# EAGLE schematic LED-Matrix_v2 (EAGLE 9.7.0)
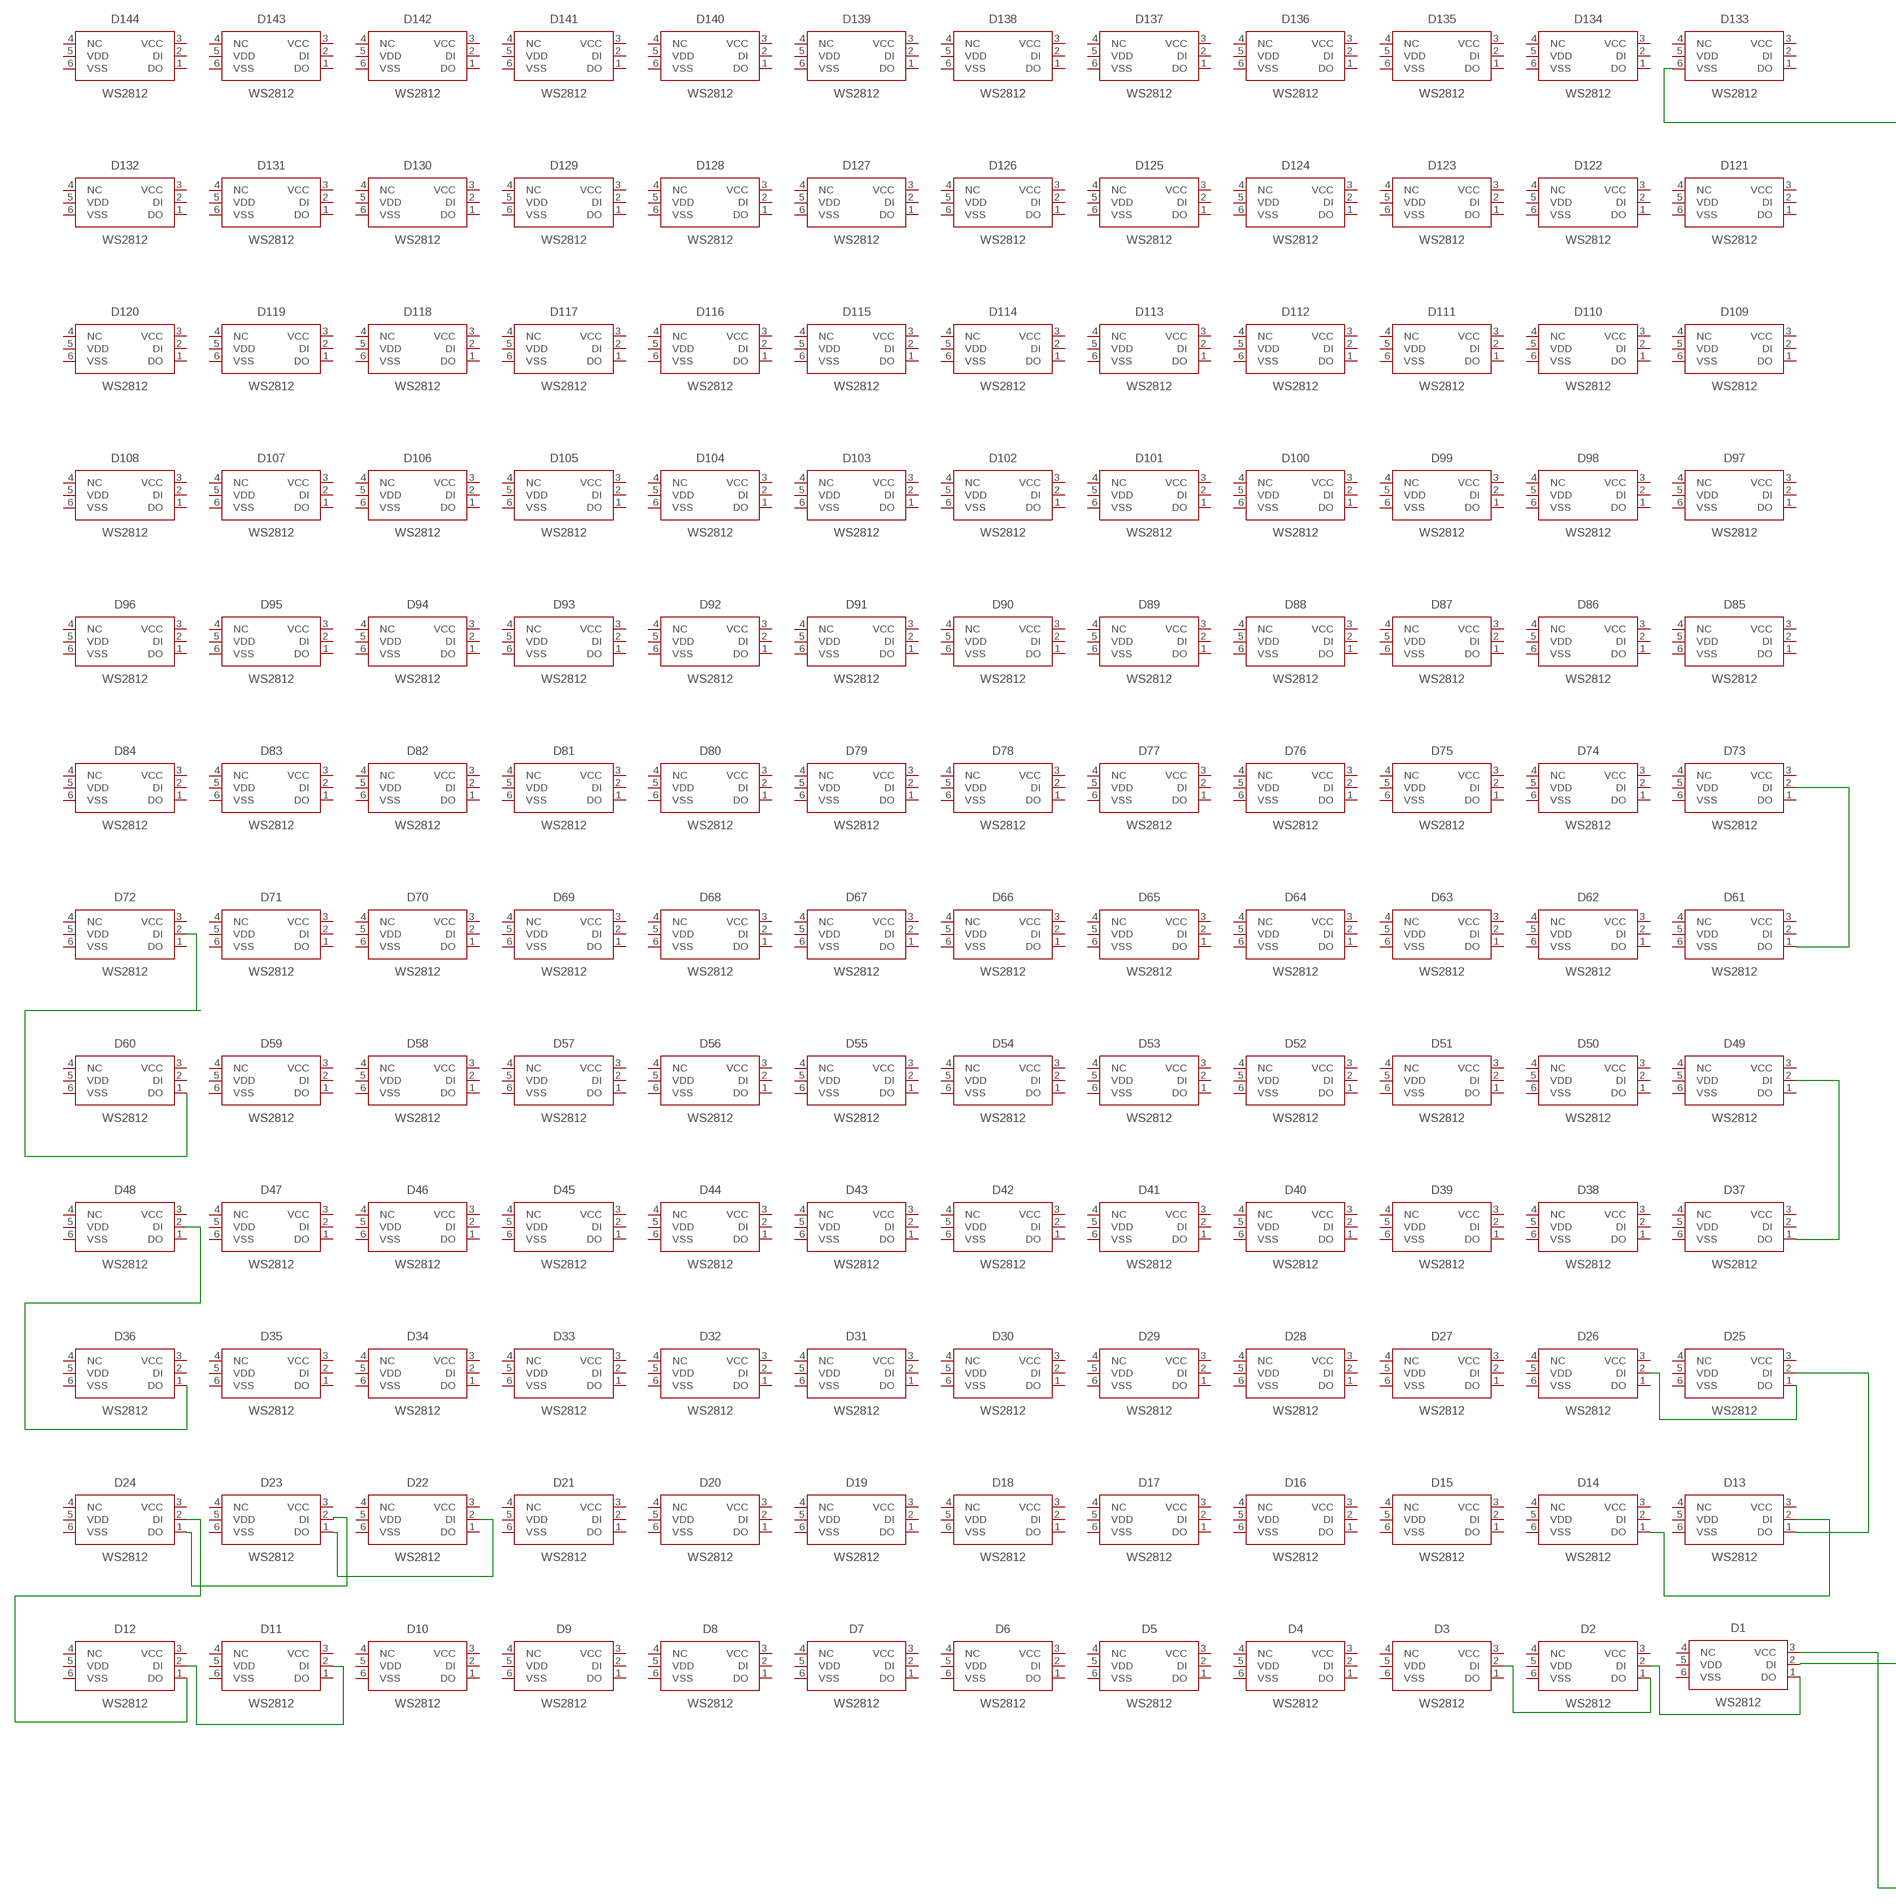
[diagram p0: schematic, sheet 1, part 1 of 2]
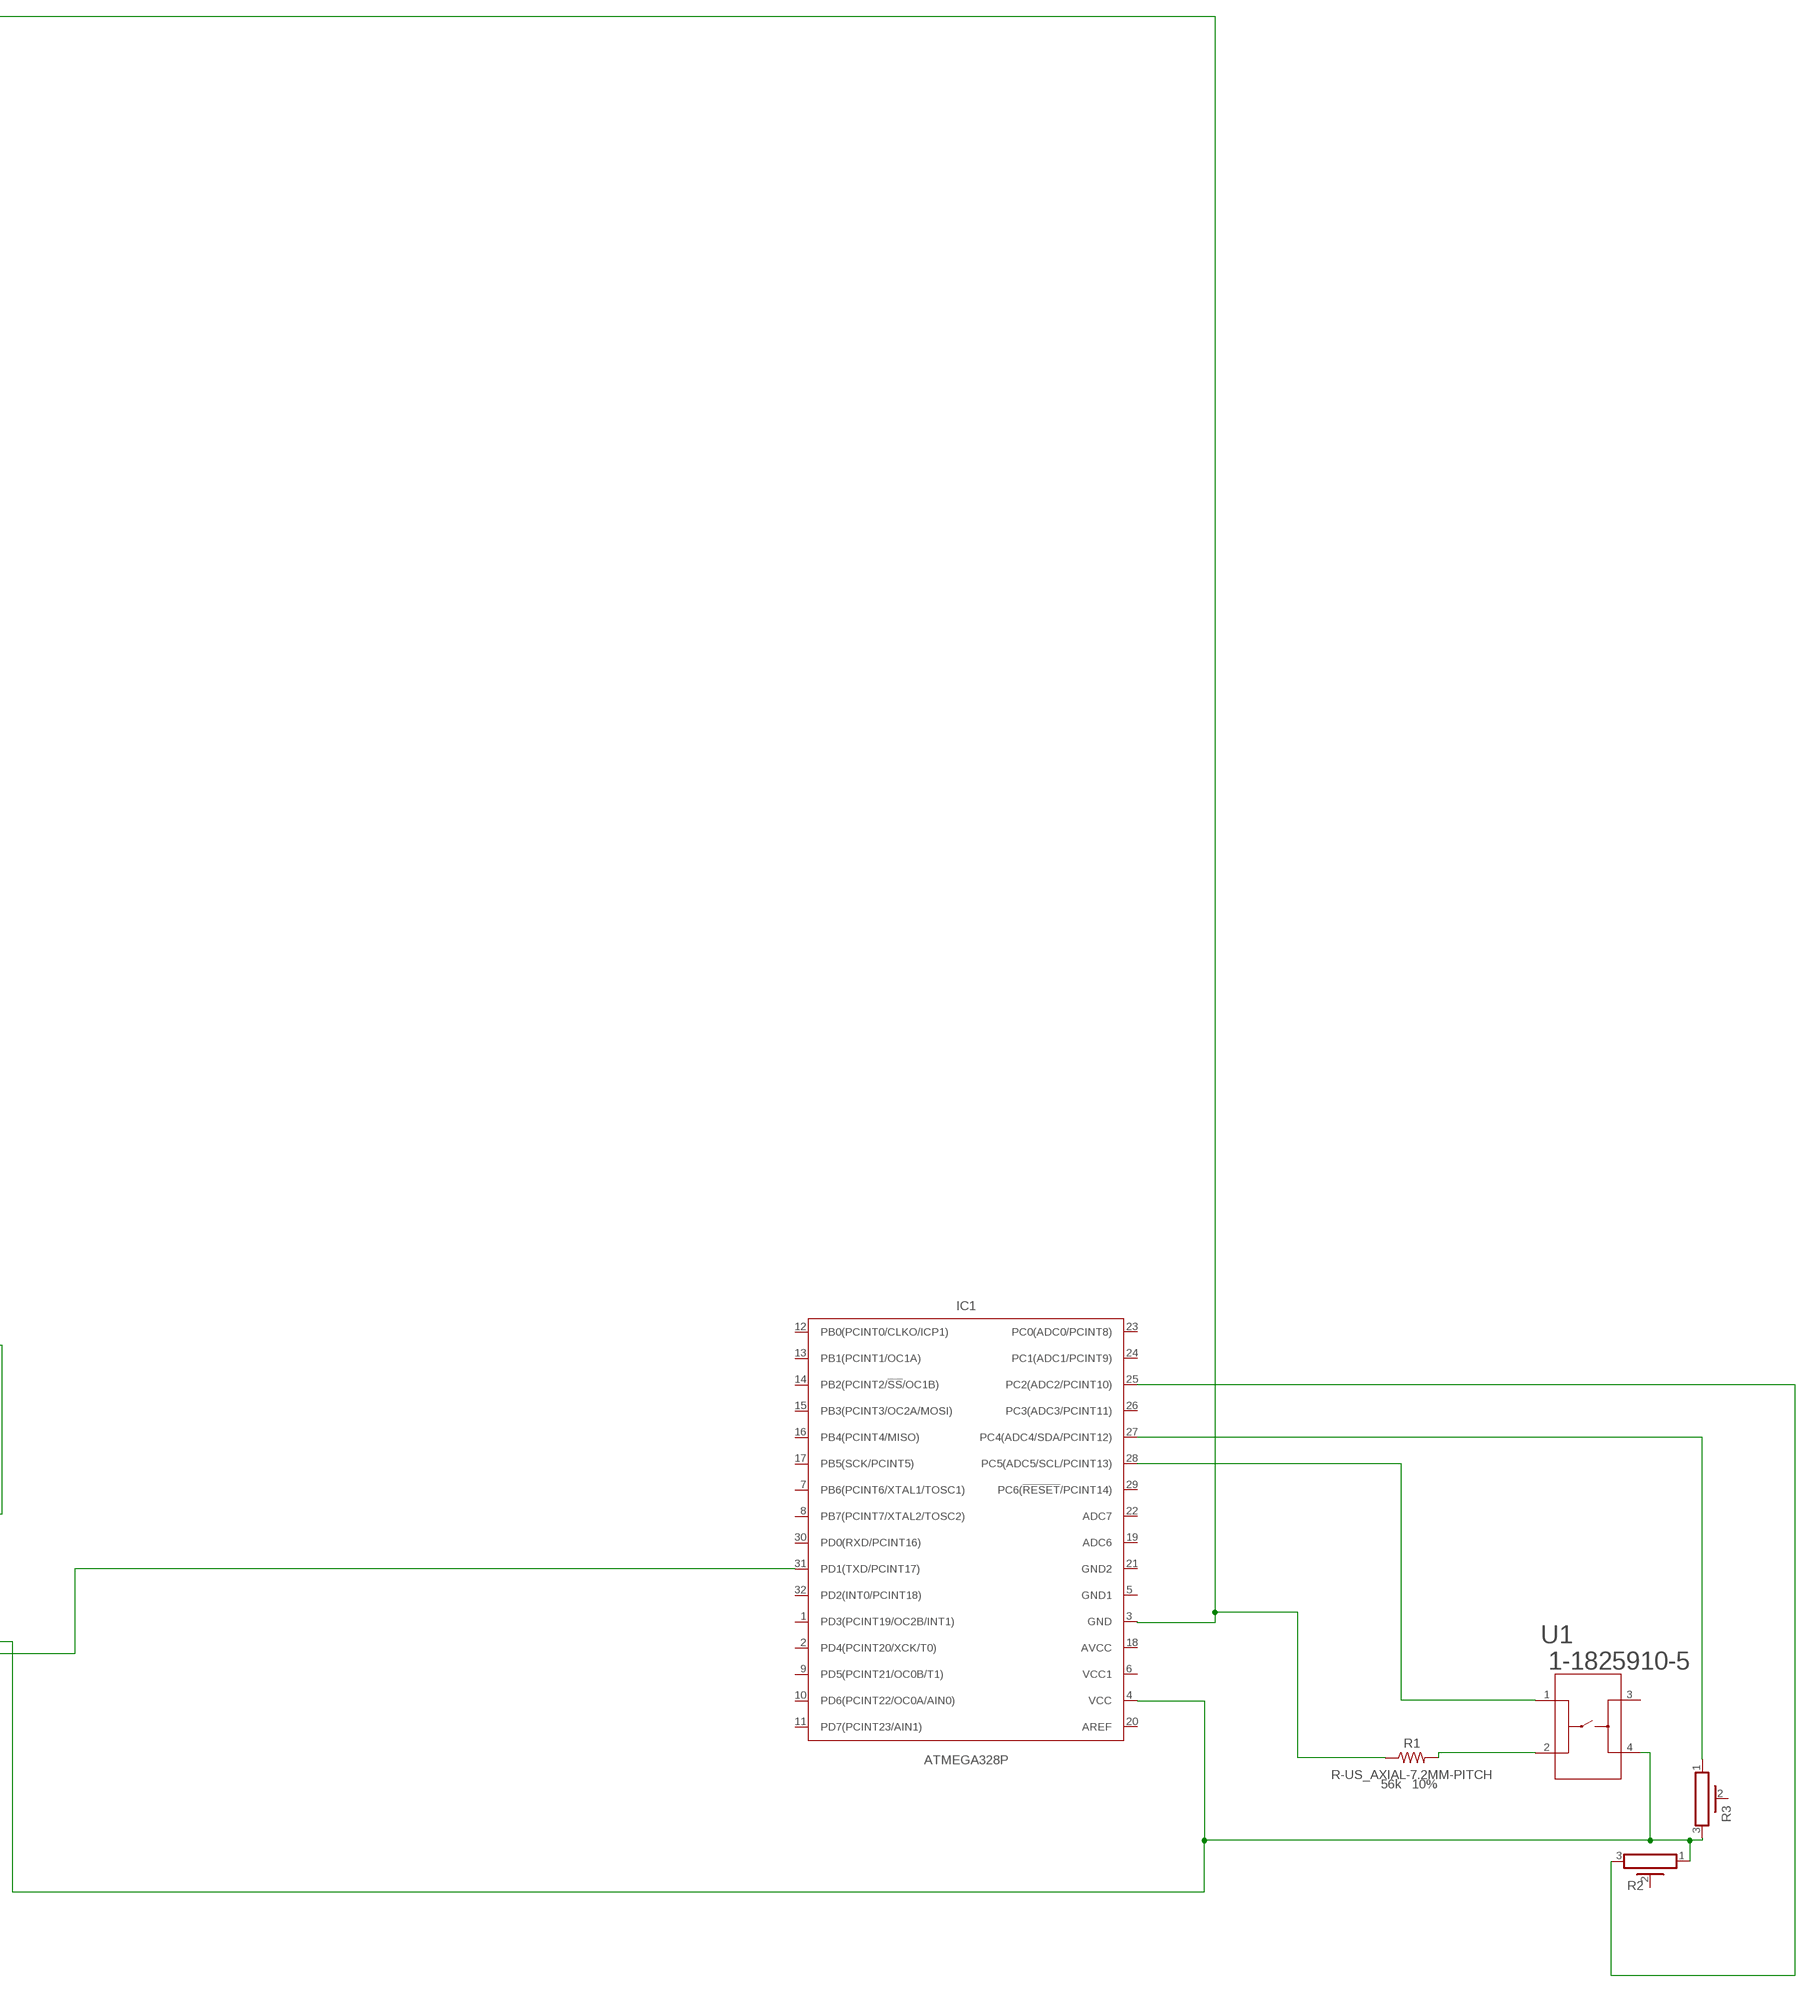
[diagram p1: schematic, sheet 1, part 2 of 2]

## Parts
D1  WS2812  [WS2812]
D2  WS2812  [WS2812]
D3  WS2812  [WS2812]
D4  WS2812  [WS2812]
D5  WS2812  [WS2812]
D6  WS2812  [WS2812]
D7  WS2812  [WS2812]
D8  WS2812  [WS2812]
D9  WS2812  [WS2812]
D10  WS2812  [WS2812]
D11  WS2812  [WS2812]
D12  WS2812  [WS2812]
D13  WS2812  [WS2812]
D14  WS2812  [WS2812]
D15  WS2812  [WS2812]
D16  WS2812  [WS2812]
D17  WS2812  [WS2812]
D18  WS2812  [WS2812]
D19  WS2812  [WS2812]
D20  WS2812  [WS2812]
D21  WS2812  [WS2812]
D22  WS2812  [WS2812]
D23  WS2812  [WS2812]
D24  WS2812  [WS2812]
D25  WS2812  [WS2812]
D26  WS2812  [WS2812]
D27  WS2812  [WS2812]
D28  WS2812  [WS2812]
D29  WS2812  [WS2812]
D30  WS2812  [WS2812]
D31  WS2812  [WS2812]
D32  WS2812  [WS2812]
D33  WS2812  [WS2812]
D34  WS2812  [WS2812]
D35  WS2812  [WS2812]
D36  WS2812  [WS2812]
D37  WS2812  [WS2812]
D38  WS2812  [WS2812]
D39  WS2812  [WS2812]
D40  WS2812  [WS2812]
D41  WS2812  [WS2812]
D42  WS2812  [WS2812]
D43  WS2812  [WS2812]
D44  WS2812  [WS2812]
D45  WS2812  [WS2812]
D46  WS2812  [WS2812]
D47  WS2812  [WS2812]
D48  WS2812  [WS2812]
D49  WS2812  [WS2812]
D50  WS2812  [WS2812]
D51  WS2812  [WS2812]
D52  WS2812  [WS2812]
D53  WS2812  [WS2812]
D54  WS2812  [WS2812]
D55  WS2812  [WS2812]
D56  WS2812  [WS2812]
D57  WS2812  [WS2812]
D58  WS2812  [WS2812]
D59  WS2812  [WS2812]
D60  WS2812  [WS2812]
D61  WS2812  [WS2812]
D62  WS2812  [WS2812]
D63  WS2812  [WS2812]
D64  WS2812  [WS2812]
D65  WS2812  [WS2812]
D66  WS2812  [WS2812]
D67  WS2812  [WS2812]
D68  WS2812  [WS2812]
D69  WS2812  [WS2812]
D70  WS2812  [WS2812]
D71  WS2812  [WS2812]
D72  WS2812  [WS2812]
D73  WS2812  [WS2812]
D74  WS2812  [WS2812]
D75  WS2812  [WS2812]
D76  WS2812  [WS2812]
D77  WS2812  [WS2812]
D78  WS2812  [WS2812]
D79  WS2812  [WS2812]
D80  WS2812  [WS2812]
D81  WS2812  [WS2812]
D82  WS2812  [WS2812]
D83  WS2812  [WS2812]
D84  WS2812  [WS2812]
D85  WS2812  [WS2812]
D86  WS2812  [WS2812]
D87  WS2812  [WS2812]
D88  WS2812  [WS2812]
D89  WS2812  [WS2812]
D90  WS2812  [WS2812]
D91  WS2812  [WS2812]
D92  WS2812  [WS2812]
D93  WS2812  [WS2812]
D94  WS2812  [WS2812]
D95  WS2812  [WS2812]
D96  WS2812  [WS2812]
D97  WS2812  [WS2812]
D98  WS2812  [WS2812]
D99  WS2812  [WS2812]
D100  WS2812  [WS2812]
D101  WS2812  [WS2812]
D102  WS2812  [WS2812]
D103  WS2812  [WS2812]
D104  WS2812  [WS2812]
D105  WS2812  [WS2812]
D106  WS2812  [WS2812]
D107  WS2812  [WS2812]
D108  WS2812  [WS2812]
D109  WS2812  [WS2812]
D110  WS2812  [WS2812]
D111  WS2812  [WS2812]
D112  WS2812  [WS2812]
D113  WS2812  [WS2812]
D114  WS2812  [WS2812]
D115  WS2812  [WS2812]
D116  WS2812  [WS2812]
D117  WS2812  [WS2812]
D118  WS2812  [WS2812]
D119  WS2812  [WS2812]
D120  WS2812  [WS2812]
D121  WS2812  [WS2812]
D122  WS2812  [WS2812]
D123  WS2812  [WS2812]
D124  WS2812  [WS2812]
D125  WS2812  [WS2812]
D126  WS2812  [WS2812]
D127  WS2812  [WS2812]
D128  WS2812  [WS2812]
D129  WS2812  [WS2812]
D130  WS2812  [WS2812]
D131  WS2812  [WS2812]
D132  WS2812  [WS2812]
D133  WS2812  [WS2812]
D134  WS2812  [WS2812]
D135  WS2812  [WS2812]
D136  WS2812  [WS2812]
D137  WS2812  [WS2812]
D138  WS2812  [WS2812]
D139  WS2812  [WS2812]
D140  WS2812  [WS2812]
D141  WS2812  [WS2812]
D142  WS2812  [WS2812]
D143  WS2812  [WS2812]
D144  WS2812  [WS2812]
IC1  ATMEGA328P  ATMEGA328P_VQFN  [QFN50P500X500X90-33T310N]
R1  R-US_AXIAL-7.2MM-PITCH  [RESAD724W46L381D178B]
R2  PV36Z  [PV36Z]
R3  PV36Z  [PV36Z]
U1  1-1825910-5  [SWITCH_1-1825910-5]

## Nets
N$1: D1.1(DO) D2.2(DI)
N$2: D2.1(DO) D3.2(DI)
N$3: D11.2(DI) D12.2(DI)
N$4: D12.1(DO) D24.2(DI)
N$5: D23.2(DI) D24.1(DO)
N$6: D22.2(DI) D23.1(DO)
N$7: D13.2(DI) D14.1(DO)
N$8: D13.1(DO) D25.2(DI)
N$9: D25.1(DO) D26.2(DI)
N$10: D36.1(DO) D48.2(DI)
N$11: D37.1(DO) D49.2(DI)
N$12: D60.1(DO)
N$13: D72.2(DI)
N$14: D61.1(DO) D73.2(DI)
N$15: D133.6(VSS) IC1.3(GND) R1.1
N$16: IC1.25(PC2(ADC2/PCINT10)) R2.3
N$17: D1.2(DI) IC1.31(PD1(TXD/PCINT17))
N$18: D1.3(VCC) IC1.4(VCC) R2.1 R3.3 U1.4
N$19: IC1.27(PC4(ADC4/SDA/PCINT12)) R3.1
N$20: R1.2 U1.2
N$21: IC1.28(PC5(ADC5/SCL/PCINT13)) U1.1
Unconnected: D1.4(NC) D2.4(NC) D3.1(DO) D3.4(NC) D4.1(DO) D4.2(DI) D4.4(NC) D5.1(DO) D5.2(DI) D5.4(NC) D6.1(DO) D6.2(DI) D6.4(NC) D7.1(DO) D7.2(DI) D7.4(NC) D8.1(DO) D8.2(DI) D8.4(NC) D9.1(DO) D9.2(DI) D9.4(NC) D10.1(DO) D10.2(DI) D10.4(NC) D11.1(DO) D11.4(NC) D12.4(NC) D13.4(NC) D14.2(DI) D14.4(NC) D15.1(DO) D15.2(DI) D15.4(NC) D16.1(DO) D16.2(DI) D16.4(NC) D17.1(DO) D17.2(DI) D17.4(NC) D18.1(DO) D18.2(DI) D18.4(NC) D19.1(DO) D19.2(DI) D19.4(NC) D20.1(DO) D20.2(DI) D20.4(NC) D21.1(DO) D21.2(DI) D21.4(NC) D22.1(DO) D22.4(NC) D23.4(NC) D24.4(NC) D25.4(NC) D26.1(DO) D26.4(NC) D27.1(DO) D27.2(DI) D27.4(NC) D28.1(DO) D28.2(DI) D28.4(NC) D29.1(DO) D29.2(DI) D29.4(NC) D30.1(DO) D30.2(DI) D30.4(NC) D31.1(DO) D31.2(DI) D31.4(NC) D32.1(DO) D32.2(DI) D32.4(NC) D33.1(DO) D33.2(DI) D33.4(NC) D34.1(DO) D34.2(DI) D34.4(NC) D35.1(DO) D35.2(DI) D35.4(NC) D36.2(DI) D36.4(NC) D37.2(DI) D37.4(NC) D38.1(DO) D38.2(DI) D38.4(NC) D39.1(DO) D39.2(DI) D39.4(NC) D40.1(DO) D40.2(DI) D40.4(NC) D41.1(DO) D41.2(DI) D41.4(NC) D42.1(DO) D42.2(DI) D42.4(NC) D43.1(DO) D43.2(DI) D43.4(NC) D44.1(DO) D44.2(DI) D44.4(NC) D45.1(DO) D45.2(DI) D45.4(NC) D46.1(DO) D46.2(DI) D46.4(NC) D47.1(DO) D47.2(DI) D47.4(NC) D48.1(DO) D48.4(NC) D49.1(DO) D49.4(NC) D50.1(DO) D50.2(DI) D50.4(NC) D51.1(DO) D51.2(DI) D51.4(NC) D52.1(DO) D52.2(DI) D52.4(NC) D53.1(DO) D53.2(DI) D53.4(NC) D54.1(DO) D54.2(DI) D54.4(NC) D55.1(DO) D55.2(DI) D55.4(NC) D56.1(DO) D56.2(DI) D56.4(NC) D57.1(DO) D57.2(DI) D57.4(NC) D58.1(DO) D58.2(DI) D58.4(NC) D59.1(DO) D59.2(DI) D59.4(NC) D60.2(DI) D60.4(NC) D61.2(DI) D61.4(NC) D62.1(DO) D62.2(DI) D62.4(NC) D63.1(DO) D63.2(DI) D63.4(NC) D64.1(DO) D64.2(DI) D64.4(NC) D65.1(DO) D65.2(DI) D65.4(NC) D66.1(DO) D66.2(DI) D66.4(NC) D67.1(DO) D67.2(DI) D67.4(NC) D68.1(DO) D68.2(DI) D68.4(NC) D69.1(DO) D69.2(DI) D69.4(NC) D70.1(DO) D70.2(DI) D70.4(NC) D71.1(DO) D71.2(DI) D71.4(NC) D72.1(DO) D72.4(NC) D73.1(DO) D73.4(NC) D74.1(DO) D74.2(DI) D74.4(NC) D75.1(DO) D75.2(DI) D75.4(NC) D76.1(DO) D76.2(DI) D76.4(NC) D77.1(DO) D77.2(DI) D77.4(NC) D78.1(DO) D78.2(DI) D78.4(NC) D79.1(DO) D79.2(DI) D79.4(NC) D80.1(DO) D80.2(DI) D80.4(NC) D81.1(DO) D81.2(DI) D81.4(NC) D82.1(DO) D82.2(DI) D82.4(NC) D83.1(DO) D83.2(DI) D83.4(NC) D84.1(DO) D84.2(DI) D84.4(NC) D85.1(DO) D85.2(DI) D85.4(NC) D86.1(DO) D86.2(DI) D86.4(NC) D87.1(DO) D87.2(DI) D87.4(NC) D88.1(DO) D88.2(DI) D88.4(NC) D89.1(DO) D89.2(DI) D89.4(NC) D90.1(DO) D90.2(DI) D90.4(NC) D91.1(DO) D91.2(DI) D91.4(NC) D92.1(DO) D92.2(DI) D92.4(NC) D93.1(DO) D93.2(DI) D93.4(NC) D94.1(DO) D94.2(DI) D94.4(NC) D95.1(DO) D95.2(DI) D95.4(NC) D96.1(DO) D96.2(DI) D96.4(NC) D97.1(DO) D97.2(DI) D97.4(NC) D98.1(DO) D98.2(DI) D98.4(NC) D99.1(DO) D99.2(DI) D99.4(NC) D100.1(DO) D100.2(DI) D100.4(NC) D101.1(DO) D101.2(DI) D101.4(NC) D102.1(DO) D102.2(DI) D102.4(NC) D103.1(DO) D103.2(DI) D103.4(NC) D104.1(DO) D104.2(DI) D104.4(NC) D105.1(DO) D105.2(DI) D105.4(NC) D106.1(DO) D106.2(DI) D106.4(NC) D107.1(DO) D107.2(DI) D107.4(NC) D108.1(DO) D108.2(DI) D108.4(NC) D109.1(DO) D109.2(DI) D109.4(NC) D110.1(DO) D110.2(DI) D110.4(NC) D111.1(DO) D111.2(DI) D111.4(NC) D112.1(DO) D112.2(DI) D112.4(NC) D113.1(DO) D113.2(DI) D113.4(NC) D114.1(DO) D114.2(DI) D114.4(NC) D115.1(DO) D115.2(DI) D115.4(NC) D116.1(DO) D116.2(DI) D116.4(NC) D117.1(DO) D117.2(DI) D117.4(NC) D118.1(DO) D118.2(DI) D118.4(NC) D119.1(DO) D119.2(DI) D119.4(NC) D120.1(DO) D120.2(DI) D120.4(NC) D121.1(DO) D121.2(DI) D121.4(NC) D122.1(DO) D122.2(DI) D122.4(NC) D123.1(DO) D123.2(DI) D123.4(NC) D124.1(DO) D124.2(DI) D124.4(NC) D125.1(DO) D125.2(DI) D125.4(NC) D126.1(DO) D126.2(DI) D126.4(NC) D127.1(DO) D127.2(DI) D127.4(NC) D128.1(DO) D128.2(DI) D128.4(NC) D129.1(DO) D129.2(DI) D129.4(NC) D130.1(DO) D130.2(DI) D130.4(NC) D131.1(DO) D131.2(DI) D131.4(NC) D132.1(DO) D132.2(DI) D132.4(NC) D133.1(DO) D133.2(DI) D133.4(NC) D134.1(DO) D134.2(DI) D134.4(NC) D135.1(DO) D135.2(DI) D135.4(NC) D136.1(DO) D136.2(DI) D136.4(NC) D137.1(DO) D137.2(DI) D137.4(NC) D138.1(DO) D138.2(DI) D138.4(NC) D139.1(DO) D139.2(DI) D139.4(NC) D140.1(DO) D140.2(DI) D140.4(NC) D141.1(DO) D141.2(DI) D141.4(NC) D142.1(DO) D142.2(DI) D142.4(NC) D143.1(DO) D143.2(DI) D143.4(NC) D144.1(DO) D144.2(DI) D144.4(NC) IC1.1(PD3(PCINT19/OC2B/INT1)) IC1.2(PD4(PCINT20/XCK/T0)) IC1.5(GND1) IC1.7(PB6(PCINT6/XTAL1/TOSC1)) IC1.8(PB7(PCINT7/XTAL2/TOSC2)) IC1.9(PD5(PCINT21/OC0B/T1)) IC1.10(PD6(PCINT22/OC0A/AIN0)) IC1.11(PD7(PCINT23/AIN1)) IC1.12(PB0(PCINT0/CLKO/ICP1)) IC1.13(PB1(PCINT1/OC1A)) IC1.14(PB2(PCINT2/!SS!/OC1B)) IC1.15(PB3(PCINT3/OC2A/MOSI)) IC1.16(PB4(PCINT4/MISO)) IC1.17(PB5(SCK/PCINT5)) IC1.19(ADC6) IC1.21(GND2) IC1.22(ADC7) IC1.23(PC0(ADC0/PCINT8)) IC1.24(PC1(ADC1/PCINT9)) IC1.26(PC3(ADC3/PCINT11)) IC1.29(PC6(!RESET!/PCINT14)) IC1.30(PD0(RXD/PCINT16)) IC1.32(PD2(INT0/PCINT18)) R2.2 R3.2 U1.3

## Power pins joined to a net without a drawn wire
AREF: IC1.20(AREF)
AVCC: IC1.18(AVCC)
VCC: D2.3(VCC) D3.3(VCC) D4.3(VCC) D5.3(VCC) D6.3(VCC) D7.3(VCC) D8.3(VCC) D9.3(VCC) D10.3(VCC) D11.3(VCC) D12.3(VCC) D13.3(VCC) D14.3(VCC) D15.3(VCC) D16.3(VCC) D17.3(VCC) D18.3(VCC) D19.3(VCC) D20.3(VCC) D21.3(VCC) D22.3(VCC) D23.3(VCC) D24.3(VCC) D25.3(VCC) D26.3(VCC) D27.3(VCC) D28.3(VCC) D29.3(VCC) D30.3(VCC) D31.3(VCC) D32.3(VCC) D33.3(VCC) D34.3(VCC) D35.3(VCC) D36.3(VCC) D37.3(VCC) D38.3(VCC) D39.3(VCC) D40.3(VCC) D41.3(VCC) D42.3(VCC) D43.3(VCC) D44.3(VCC) D45.3(VCC) D46.3(VCC) D47.3(VCC) D48.3(VCC) D49.3(VCC) D50.3(VCC) D51.3(VCC) D52.3(VCC) D53.3(VCC) D54.3(VCC) D55.3(VCC) D56.3(VCC) D57.3(VCC) D58.3(VCC) D59.3(VCC) D60.3(VCC) D61.3(VCC) D62.3(VCC) D63.3(VCC) D64.3(VCC) D65.3(VCC) D66.3(VCC) D67.3(VCC) D68.3(VCC) D69.3(VCC) D70.3(VCC) D71.3(VCC) D72.3(VCC) D73.3(VCC) D74.3(VCC) D75.3(VCC) D76.3(VCC) D77.3(VCC) D78.3(VCC) D79.3(VCC) D80.3(VCC) D81.3(VCC) D82.3(VCC) D83.3(VCC) D84.3(VCC) D85.3(VCC) D86.3(VCC) D87.3(VCC) D88.3(VCC) D89.3(VCC) D90.3(VCC) D91.3(VCC) D92.3(VCC) D93.3(VCC) D94.3(VCC) D95.3(VCC) D96.3(VCC) D97.3(VCC) D98.3(VCC) D99.3(VCC) D100.3(VCC) D101.3(VCC) D102.3(VCC) D103.3(VCC) D104.3(VCC) D105.3(VCC) D106.3(VCC) D107.3(VCC) D108.3(VCC) D109.3(VCC) D110.3(VCC) D111.3(VCC) D112.3(VCC) D113.3(VCC) D114.3(VCC) D115.3(VCC) D116.3(VCC) D117.3(VCC) D118.3(VCC) D119.3(VCC) D120.3(VCC) D121.3(VCC) D122.3(VCC) D123.3(VCC) D124.3(VCC) D125.3(VCC) D126.3(VCC) D127.3(VCC) D128.3(VCC) D129.3(VCC) D130.3(VCC) D131.3(VCC) D132.3(VCC) D133.3(VCC) D134.3(VCC) D135.3(VCC) D136.3(VCC) D137.3(VCC) D138.3(VCC) D139.3(VCC) D140.3(VCC) D141.3(VCC) D142.3(VCC) D143.3(VCC) D144.3(VCC)
VCC1: IC1.6(VCC1)
VDD: D1.5(VDD) D2.5(VDD) D3.5(VDD) D4.5(VDD) D5.5(VDD) D6.5(VDD) D7.5(VDD) D8.5(VDD) D9.5(VDD) D10.5(VDD) D11.5(VDD) D12.5(VDD) D13.5(VDD) D14.5(VDD) D15.5(VDD) D16.5(VDD) D17.5(VDD) D18.5(VDD) D19.5(VDD) D20.5(VDD) D21.5(VDD) D22.5(VDD) D23.5(VDD) D24.5(VDD) D25.5(VDD) D26.5(VDD) D27.5(VDD) D28.5(VDD) D29.5(VDD) D30.5(VDD) D31.5(VDD) D32.5(VDD) D33.5(VDD) D34.5(VDD) D35.5(VDD) D36.5(VDD) D37.5(VDD) D38.5(VDD) D39.5(VDD) D40.5(VDD) D41.5(VDD) D42.5(VDD) D43.5(VDD) D44.5(VDD) D45.5(VDD) D46.5(VDD) D47.5(VDD) D48.5(VDD) D49.5(VDD) D50.5(VDD) D51.5(VDD) D52.5(VDD) D53.5(VDD) D54.5(VDD) D55.5(VDD) D56.5(VDD) D57.5(VDD) D58.5(VDD) D59.5(VDD) D60.5(VDD) D61.5(VDD) D62.5(VDD) D63.5(VDD) D64.5(VDD) D65.5(VDD) D66.5(VDD) D67.5(VDD) D68.5(VDD) D69.5(VDD) D70.5(VDD) D71.5(VDD) D72.5(VDD) D73.5(VDD) D74.5(VDD) D75.5(VDD) D76.5(VDD) D77.5(VDD) D78.5(VDD) D79.5(VDD) D80.5(VDD) D81.5(VDD) D82.5(VDD) D83.5(VDD) D84.5(VDD) D85.5(VDD) D86.5(VDD) D87.5(VDD) D88.5(VDD) D89.5(VDD) D90.5(VDD) D91.5(VDD) D92.5(VDD) D93.5(VDD) D94.5(VDD) D95.5(VDD) D96.5(VDD) D97.5(VDD) D98.5(VDD) D99.5(VDD) D100.5(VDD) D101.5(VDD) D102.5(VDD) D103.5(VDD) D104.5(VDD) D105.5(VDD) D106.5(VDD) D107.5(VDD) D108.5(VDD) D109.5(VDD) D110.5(VDD) D111.5(VDD) D112.5(VDD) D113.5(VDD) D114.5(VDD) D115.5(VDD) D116.5(VDD) D117.5(VDD) D118.5(VDD) D119.5(VDD) D120.5(VDD) D121.5(VDD) D122.5(VDD) D123.5(VDD) D124.5(VDD) D125.5(VDD) D126.5(VDD) D127.5(VDD) D128.5(VDD) D129.5(VDD) D130.5(VDD) D131.5(VDD) D132.5(VDD) D133.5(VDD) D134.5(VDD) D135.5(VDD) D136.5(VDD) D137.5(VDD) D138.5(VDD) D139.5(VDD) D140.5(VDD) D141.5(VDD) D142.5(VDD) D143.5(VDD) D144.5(VDD)
VSS: D1.6(VSS) D2.6(VSS) D3.6(VSS) D4.6(VSS) D5.6(VSS) D6.6(VSS) D7.6(VSS) D8.6(VSS) D9.6(VSS) D10.6(VSS) D11.6(VSS) D12.6(VSS) D13.6(VSS) D14.6(VSS) D15.6(VSS) D16.6(VSS) D17.6(VSS) D18.6(VSS) D19.6(VSS) D20.6(VSS) D21.6(VSS) D22.6(VSS) D23.6(VSS) D24.6(VSS) D25.6(VSS) D26.6(VSS) D27.6(VSS) D28.6(VSS) D29.6(VSS) D30.6(VSS) D31.6(VSS) D32.6(VSS) D33.6(VSS) D34.6(VSS) D35.6(VSS) D36.6(VSS) D37.6(VSS) D38.6(VSS) D39.6(VSS) D40.6(VSS) D41.6(VSS) D42.6(VSS) D43.6(VSS) D44.6(VSS) D45.6(VSS) D46.6(VSS) D47.6(VSS) D48.6(VSS) D49.6(VSS) D50.6(VSS) D51.6(VSS) D52.6(VSS) D53.6(VSS) D54.6(VSS) D55.6(VSS) D56.6(VSS) D57.6(VSS) D58.6(VSS) D59.6(VSS) D60.6(VSS) D61.6(VSS) D62.6(VSS) D63.6(VSS) D64.6(VSS) D65.6(VSS) D66.6(VSS) D67.6(VSS) D68.6(VSS) D69.6(VSS) D70.6(VSS) D71.6(VSS) D72.6(VSS) D73.6(VSS) D74.6(VSS) D75.6(VSS) D76.6(VSS) D77.6(VSS) D78.6(VSS) D79.6(VSS) D80.6(VSS) D81.6(VSS) D82.6(VSS) D83.6(VSS) D84.6(VSS) D85.6(VSS) D86.6(VSS) D87.6(VSS) D88.6(VSS) D89.6(VSS) D90.6(VSS) D91.6(VSS) D92.6(VSS) D93.6(VSS) D94.6(VSS) D95.6(VSS) D96.6(VSS) D97.6(VSS) D98.6(VSS) D99.6(VSS) D100.6(VSS) D101.6(VSS) D102.6(VSS) D103.6(VSS) D104.6(VSS) D105.6(VSS) D106.6(VSS) D107.6(VSS) D108.6(VSS) D109.6(VSS) D110.6(VSS) D111.6(VSS) D112.6(VSS) D113.6(VSS) D114.6(VSS) D115.6(VSS) D116.6(VSS) D117.6(VSS) D118.6(VSS) D119.6(VSS) D120.6(VSS) D121.6(VSS) D122.6(VSS) D123.6(VSS) D124.6(VSS) D125.6(VSS) D126.6(VSS) D127.6(VSS) D128.6(VSS) D129.6(VSS) D130.6(VSS) D131.6(VSS) D132.6(VSS) D134.6(VSS) D135.6(VSS) D136.6(VSS) D137.6(VSS) D138.6(VSS) D139.6(VSS) D140.6(VSS) D141.6(VSS) D142.6(VSS) D143.6(VSS) D144.6(VSS)

## Library data of the parts
D1-D144 = LED:WS2812: Intelligent control LED integrated light source Datasheet <https://www.adafruit.com/datasheets/WS2812.pdf>; CATEGORY: LED; COLOR: RGB; DESCRIPTION: LED integrated light source; MANUFACTURER: Worldsemi; MPN: WS2812; PART_STATUS: ACTIVE; SERIES: WS2812; SUB_CATEGORY: RGB
IC1 = IC_Embedded:ATMEGA328P: 8-bit AVR Microcontroller with 32K Bytes In-System Programmable Flash Datasheet <http://ww1.microchip.com/downloads/en/DeviceDoc/Atmel-7810-Automotive-Microcontrollers-ATmega328P_Datasheet.pdf>; CATEGORY: IC_Embedded; MANUFACTURER: Microchip; MPN: ATmega328P-AU; OPERATING_TEMP: -40 to 85 °C; PART_STATUS: Active; SUB-CATEGORY: Microcontroller
R1 = Resistor:R-US: Resistor Fixed - ANSI; CATEGORY: Resistor; RATING: 56k; SUB-CATEGORY: Fixed; TOLERANCE: 10%
R2 R3 = Resistor:PV36: Rectangular Trimmer Potentiometers - PV36 Series Datasheet <https://www.bourns.com/docs/Product-Datasheets/pv36.pdf>; CATEGORY: Resistor; DESCRIPTION: Lead Sealed Type Multiturn PV36 Series; MANUFACTURER: BOURNS; MPN: PV36Z; OPERATING_TEMPERATURE: -55 to +125 °C; PART_STATUS: Active; ROHS_COMPLIANCE: RoHS Compliant; SERIES: PV36; SUB-CATEGORY: Trimpot; TYPE: Lead Sealed
U1 = Switches:1-1825910-5; BUILT_BY: EMA_UL_Team; CATEGORY: Tactile Switches; COPYRIGHT: Copyright (C) 2016 Accelerated Designs. All rights reserved; DESCRIPTION: FSM8JAH=6MM TACT SWITCH, HIGH TEMP; MANUFACTURER_PART_NUMBER: 1-1825910-5; PART_STATUS: active; SERIES: Unknown; VENDOR: TE Connectivity